# EAGLE design Wheel Speed Sensor smd (EAGLE 9.5.0)
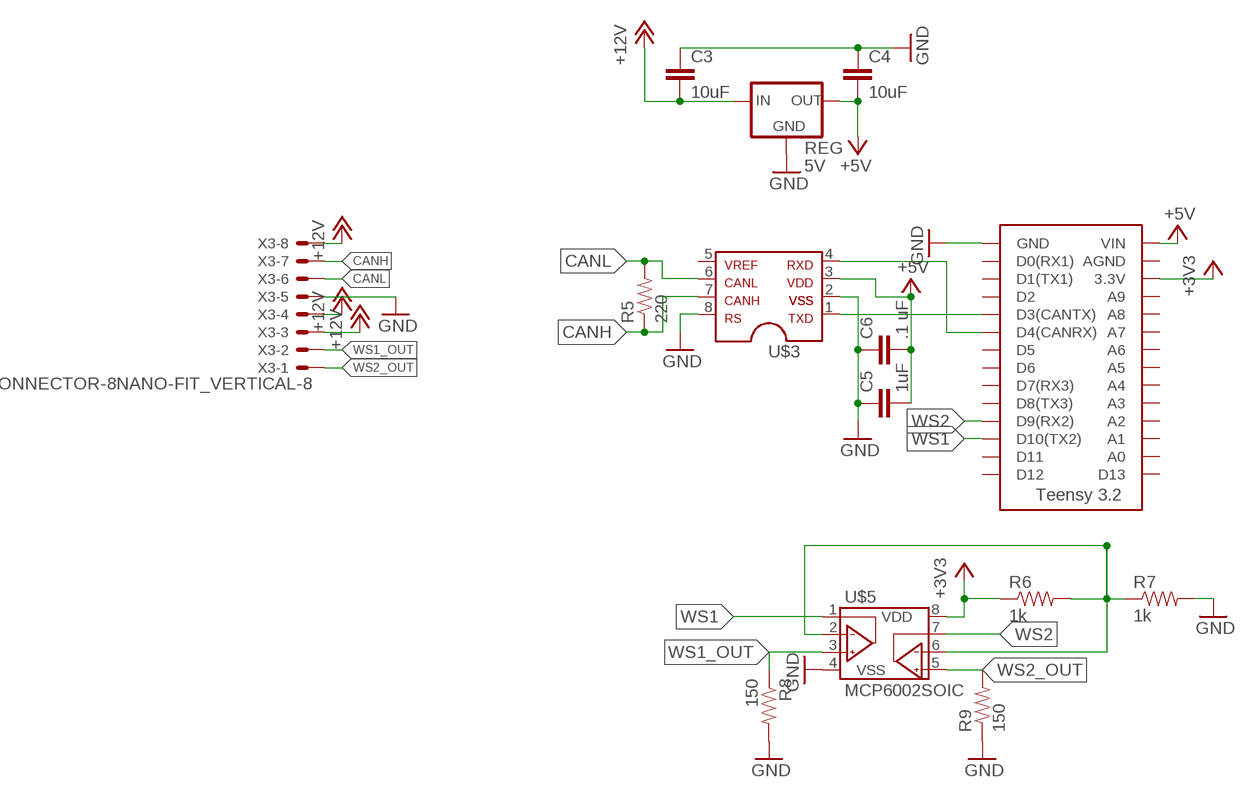
[diagram p0: schematic, sheet 1]

## Parts
C3  10uF  CAP0603-CAP  [0603-CAP]
C4  10uF  CAP0603-CAP  [0603-CAP]
C5  1uF  CAP0603-CAP  [0603-CAP]
C6  .1 uF  CAP0603-CAP  [0603-CAP]
R5  220  RESISTOR0603  [0603-RES]
R6  1k  RESISTOR0603-RES  [0603-RES]
R7  1k  RESISTOR0603-RES  [0603-RES]
R8  150  RESISTOR0603-RES  [0603-RES]
R9  150  RESISTOR0603-RES  [0603-RES]
REG  5V  OKI-78SR-5  [OKI-78SR]
U$2  TEENSY_3.2_SIMPLE  [TEENSY_3.2_SIMPLE]
U$3  MCP2551  [SOIC-08]
U$5  MCP6002SOIC  [SOIC-08]
X3  CONNECTOR-8NANO-FIT_VERTICAL-8  [NANO-FIT_VERTICAL-8]

## Nets
+3V3: R6.1 U$2.3.3V U$5.8(VDD)
+5V: C4.2 C5.2 C6.2 REG.3(OUT) U$2.VIN U$3.3
+12V: C3.2 REG.1(IN) X3.P$3 X3.P$4 X3.P$8
CANH: R5.1 U$3.7 X3.P$7
CANL: R5.2 U$3.6 X3.P$6
GND: C3.1 C4.1 C5.1 C6.1 R7.2 R8.2 R9.1 REG.2(GND) U$2.GND U$3.2 U$3.8 U$5.4(VSS) X3.P$5
N$3: U$2.D3(CANTX) U$3.1
N$7: U$2.D4(CANRX) U$3.4
N$10: R6.2 R7.1 U$5.2(VINA-) U$5.6(VINB-)
WS1: U$2.D10(TX2) U$5.1(VOUTA)
WS1_OUT: R8.1 U$5.3(VINA+) X3.P$2
WS2: U$2.D9(RX2) U$5.7(VOUTB)
WS2_OUT: R9.2 U$5.5(VINB+) X3.P$1
Unconnected: U$2.A0 U$2.A1 U$2.A2 U$2.A3 U$2.A4 U$2.A5 U$2.A6 U$2.A7 U$2.A8 U$2.A9 U$2.AGND U$2.D0(RX1) U$2.D1(TX1) U$2.D2 U$2.D5 U$2.D6 U$2.D7(RX3) U$2.D8(TX3) U$2.D11 U$2.D12 U$2.D13 U$3.5

## Library data of the parts
C3-C6 = HyTechDevices:CAP: Capacitor Standard 0603 ceramic capacitor, and 0.1" leaded capacitor.
R5-R9 = HyTechDevices:RESISTOR: Resistor Basic schematic elements and footprints for 0603, 1206, and PTH resistors.
REG = HyTechDevices:OKI-78SR-5: Murata OKI-78SR 5V 1.5A Non-Isolated Switching Regulator DC/DC - Datasheet <https://power.murata.com/data/power/oki-78sr.pdf>
U$2 = HyTechDevices:TEENSY_3.2_SIMPLE: Simple version of the Teensy 3.2 board that only uses the 2 main rows of pins, not the inner pins or the pins opposite the usb port.
U$3 = HyTechDevices:MCP2551: MCP2551 High-Speed CAN Transceiver Product Webpage <https://www.microchip.com/wwwproducts/en/MCP2551> Datasheet <http://ww1.microchip.com/downloads/en/DeviceDoc/21667f.pdf> This device is outdated It is replaced by MCP2561. Comparison Page <https://www.microchip.com/wwwproducts/ProductCompare/MCP2551/MCP2561> Product Webpage <https://www.microchip.com/wwwproducts/en/MCP2561> Datasheet <http://ww1.microchip.com/downloads/en/DeviceDoc/20005167C.pdf>
U$5 = HyTechDevices:MCP6002: Microchip MCP6002 Dual Channel Op Amp
X3 = HyTechDevices:CONNECTOR-8: Mini-Fit Junior connector 8 pole Source: http://www.molex.com

## Board
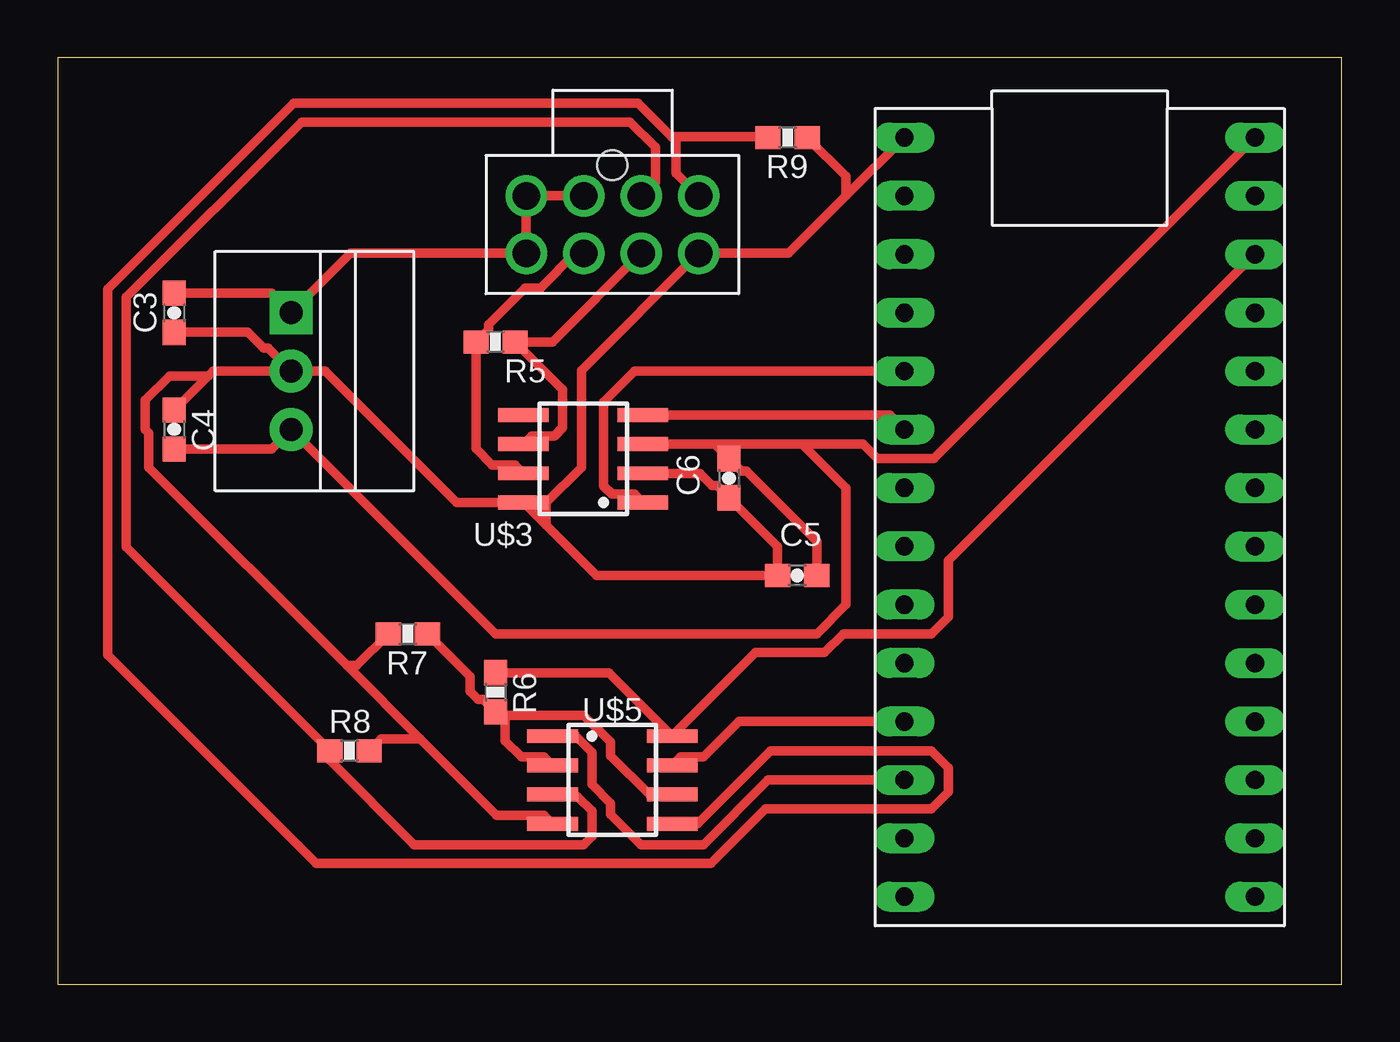
[diagram p1: board, top side]

Size 55.86 x 40.31 mm. Coordinates in mm from the lower left corner, seen from the top.
Outline: 0,0 55.86,0 55.86,40.31 0,40.31 0,0
Copper layers (1+2*15+16): Top 0.035mm / dielectric 0.18mm / Route2 0.017mm / dielectric 1.12mm / Route15 0.017mm / dielectric 0.18mm / Bottom 0.035mm
Design rules "DRC JLC 4-layer": minimum track width 6mil, minimum drill 10mil, track to track 6mil, track to pad 6mil, pad to pad 6mil, via to via 6mil, smd to smd 6mil, copper to edge 40mil, drill to drill 6mil, minimum pad ring 10mil, minimum via ring 8mil, stop-mask expansion 4mil, vias tented up to drill 0mil, thermal gap 10mil

### Footprints (pad centres in the part's own frame; a part is rotated, then mirrored left to right if it is on the bottom)
0603-CAP = smd 1.1 x 1: 1 -0.85,0; 2 0.85,0
0603-RES = smd 1.1 x 1: 1 -0.85,0; 2 0.85,0
OKI-78SR = drill 1 pad 1.88 square: 1 -2.54,0 | drill 1 pad 1.88: 2 0,0; 3 2.54,0
TEENSY_3.2_SIMPLE = drill 0.8 long: 3.3V 16.51,29.21; A0 16.51,3.81; A1 16.51,6.35; A2 16.51,8.89; A3 16.51,11.43; A4 16.51,13.97; A5 16.51,16.51; A6 16.51,19.05; A7 16.51,21.59; A8 16.51,24.13; A9 16.51,26.67; AGND 16.51,31.75; D0(RX1) 1.27,31.75; D1(TX1) 1.27,29.21; D2 1.27,26.67; D3(CANTX) 1.27,24.13; D4(CANRX) 1.27,21.59; D5 1.27,19.05; D6 1.27,16.51; D7(RX3) 1.27,13.97; D8(TX3) 1.27,11.43; D9(RX2) 1.27,8.89; D10(TX2) 1.27,6.35; D11 1.27,3.81; D12 1.27,1.27; D13 16.51,1.27; GND 1.27,34.29; VIN 16.51,34.29
SOIC-08 = smd 0.6 x 2.2: 1 -1.905,-2.6; 2 -0.635,-2.6; 3 0.635,-2.6; 4 1.905,-2.6; 5 1.905,2.6; 6 0.635,2.6; 7 -0.635,2.6; 8 -1.905,2.6
NANO-FIT_VERTICAL-8 = drill 1.2: P$1 -3.75,0; P$2 -1.25,0; P$3 1.25,0; P$4 3.75,0; P$5 -3.75,2.5; P$6 -1.25,2.5; P$7 1.25,2.5; P$8 3.75,2.5 | hole 1.3: 0,-1.34

### Placement (x,y rotation side)
C3  5.08,29.21 90 top
C4  5.08,24.13 270 top
C5  32.17,17.78 0 top
C6  29.21,22.01 90 top
R5  19.05,27.94 0 top
R6  19.05,12.7 270 top
R7  15.24,15.24 180 top
R8  12.7,10.16 0 top
R9  31.75,36.83 180 top
REG  10.16,26.67 270 top
U$2  35.56,2.54 0 top
U$3  22.86,22.86 90 top
U$5  24.13,8.89 270 top
X3  24.13,34.29 180 top

### Tracks (layer width: path | path; a pad name or v marks a point on that pad's centre or on a via)
+3V3
  Top 0.406: U$2.3.3V 38.75,18.43 38.75,15.99 38.01,15.25 34.18,15.25 33.36,14.43 30.36,14.43 U$5.8 23.98,13.55 R6.1
+5V
  Top 0.406: U$3.3 28.57,23.49 | 28.57,23.49 C6.2 29.75,22.32 29.96,22.32 33.02,19.26 C5.2 | 28.57,23.49 32.38,23.49 | 32.38,23.49 35.02,23.49 35.65,22.87 38.11,22.87 U$2.VIN | 32.38,23.49 34.29,21.59 34.29,16.51 33.02,15.24 19.05,15.24 REG.3 9.31,23.28 C4.2
+12V
  Top 0.406: C3.2 9.31,30.06 REG.1 12.74,31.79 X3.P$8 X3.P$4 X3.P$3
CANH
  Top 0.406: U$3.7 19.9,22.59 18.91,22.59 18.2,23.29 R5.1 18.74,28.48 18.74,28.69 20.33,30.28 21,30.28 22.52,31.79 X3.P$7
CANL
  Top 0.406: U$3.6 20.62,23.86 21.61,23.86 21.97,24.21 21.97,25.87 R5.2 21.53,27.94 X3.P$6
GND
  Top 0.406: U$3.2 27.93,22.22 28.46,21.7 28.67,21.7 C6.1 31.32,19.05 C5.1 23.43,17.78 21.24,19.97 | 21.24,19.97 U$3.8 17.35,20.95 11.63,26.67 REG.2 | 34.29,34.29 31.79,31.79 X3.P$5 22.78,26.69 22.78,22.48 21.24,20.95 21.24,19.97 | 34.29,34.29 U$2.GND | REG.2 9.17,27.66 8.97,27.66 8.27,28.36 C3.1 | C4.1 6.56,26.46 | 6.56,26.46 6.77,26.67 REG.2 | 12.59,13.86 3.97,22.48 3.97,23.97 3.81,24.13 3.81,25.4 4.87,26.46 6.56,26.46 | 12.59,13.86 15.76,10.68 | 15.76,10.68 19.1,7.34 21.17,7.34 U$5.4 | R8.2 14.07,10.68 15.76,10.68 | R9.1 34.29,35.14 34.29,34.29 | R7.2 13.01,13.86 12.59,13.86
N$3
  Top 0.406: U$3.1 25.1,21.31 24.11,21.31 23.75,21.67 23.75,25.32 25.1,26.67 U$2.D3(CANTX)
N$7
  Top 0.406: U$3.4 36.2,24.77 U$2.D4(CANRX)
N$10
  Top 0.406: U$5.2 21.17,9.88 20.18,9.88 19.47,10.59 19.47,11.43 R6.2 | R6.2 18.51,12.39 18.3,12.39 17.94,12.75 17.94,13.39 R7.1 | R6.2 19.2,11.7 22.88,11.7 24.05,10.54 24.05,9.94 25.74,8.25 U$5.6
WS1
  Top 0.406: U$2.D10(TX2) 30.9,8.89 28.08,6.08 25.38,6.08 24.05,7.4 24.05,7.87 23.24,8.69 23.24,10.08 22.52,10.8 U$5.1
WS1_OUT
  Top 0.406: U$5.3 21.63,8.16 22.62,8.16 23.24,7.54 23.24,6.43 22.88,6.08 15.52,6.08 11.85,9.74 R8.1 3,19.01 3,29.89 10.61,37.5 24.9,37.5 26,36.4 26,34.86 25.95,34.86 X3.P$2
WS2
  Top 0.406: U$5.7 27.09,9.88 28.08,9.88 29.63,11.43 U$2.D9(RX2)
WS2_OUT
  Top 0.406: U$5.5 27.84,6.99 31.01,10.15 38.01,10.15 38.75,9.41 38.75,8.37 38.01,7.63 30.78,7.63 28.42,5.26 15.24,5.26 14.84,5.26 11.25,5.26 2.18,14.33 2.18,30.23 10.27,38.31 25.24,38.31 26.7,36.86 | 26.7,36.86 26.89,36.66 26.89,35.28 X3.P$1 | 26.7,36.86 30.87,36.86 R9.2